# EAGLE design satshakit_cnc (EAGLE 7.5.0)
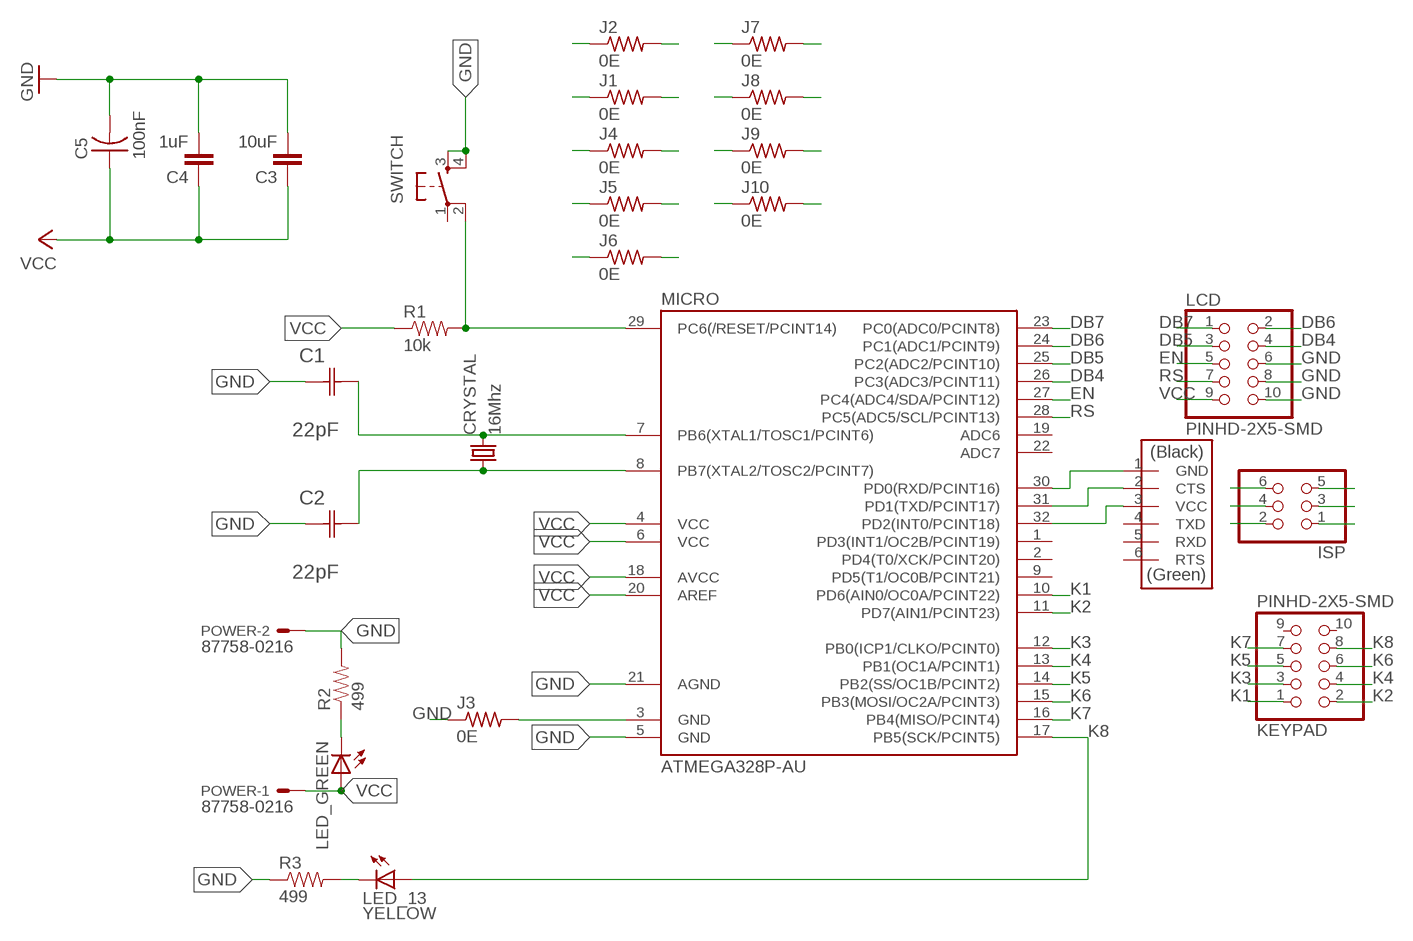
[diagram p0: schematic, sheet 1]

## Parts
C1  22pF  0612ZC225MAT2A  [CAPC3216X178N]
C2  22pF  0612ZC225MAT2A  [CAPC3216X178N]
C3  10uF  CAP1206  [1206]
C4  1uF  CAP1206  [1206]
C5  100nF  CAP-US1206FAB  [C1206FAB]
CRYSTAL  16Mhz  CSM-7X-DU  [CSM-7X-DU]
GSM  FTDI-SMD-HEADER  [1X06SMD]
ISP  PINHD-2X3-SMD  [2X03SMD]
J1  0E  RES-US1206FAB  [R1206FAB]
J2  0E  RES-US1206FAB  [R1206FAB]
J3  0E  RES-US1206FAB  [R1206FAB]
J4  0E  RES-US1206FAB  [R1206FAB]
J5  0E  RES-US1206FAB  [R1206FAB]
J6  0E  RES-US1206FAB  [R1206FAB]
J7  0E  RES-US1206FAB  [R1206FAB]
J8  0E  RES-US1206FAB  [R1206FAB]
J9  0E  RES-US1206FAB  [R1206FAB]
J10  0E  RES-US1206FAB  [R1206FAB]
KEYPAD  PINHD-2X5-SMD  [2X05SMD]
LCD  PINHD-2X5-SMD  [2X05SMD]
LED_13  YELLOW  LED1206  [1206]
LED_GREEN  LED1206  [1206]
MICRO  ATMEGA328P-AU  ATMEGA48/88/168-AU  [TQFP32-08]
POWER  87758-0216  [87758-0216]
R1  10k  RESISTOR1206  [1206]
R2  499  RESISTOR1206  [1206]
R3  499  RESISTOR1206  [1206]
SWITCH  6MM_SWITCH6MM_SWITCH  [6MM_SWITCH]

## Nets
DB4: LCD.4 MICRO.26(PC3(ADC3/PCINT11))
DB5: LCD.3 MICRO.25(PC2(ADC2/PCINT10))
DB6: LCD.2 MICRO.24(PC1(ADC1/PCINT9))
DB7: LCD.1 MICRO.23(PC0(ADC0/PCINT8))
EN: LCD.5 MICRO.27(PC4(ADC4/SDA/PCINT12))
GND: C1.1(C1) C2.1(C1) C3.2 C4.2 C5.2 ISP.6 J3.1 J3.2 J8.1 J8.2 J10.1 J10.2 LCD.6 LCD.8 LCD.10 MICRO.3(GND) MICRO.5(GND) MICRO.21(AGND) POWER.2 R2.2 R3.1 SWITCH.3(S) SWITCH.4(S1)
K1: KEYPAD.1 MICRO.10(PD6(AIN0/OC0A/PCINT22))
K2: KEYPAD.2 MICRO.11(PD7(AIN1/PCINT23))
K3: KEYPAD.3 MICRO.12(PB0(ICP1/CLKO/PCINT0))
K4: KEYPAD.4 MICRO.13(PB1(OC1A/PCINT1))
K5: KEYPAD.5 MICRO.14(PB2(SS/OC1B/PCINT2))
K6: ISP.4 KEYPAD.6 MICRO.15(PB3(MOSI/OC2A/PCINT3))
K7: ISP.1 J5.1 J5.2 KEYPAD.7 MICRO.16(PB4(MISO/PCINT4))
K8: ISP.3 J4.1 J4.2 KEYPAD.8 LED_13.1(A) MICRO.17(PB5(SCK/PCINT5))
N$1: GSM.1(GND) MICRO.30(PD0(RXD/PCINT16))
N$2: C1.2(C2) CRYSTAL.2 MICRO.7(PB6(XTAL1/TOSC1/PCINT6))
N$3: GSM.2(CTS) MICRO.31(PD1(TXD/PCINT17))
N$4: GSM.3(VCC) MICRO.32(PD2(INT0/PCINT18))
N$9: C2.2(C2) CRYSTAL.1 MICRO.8(PB7(XTAL2/TOSC2/PCINT7))
N$26: LED_GREEN.2(C) R2.1
N$27: LED_13.2(C) R3.2
RS: LCD.7 MICRO.28(PC5(ADC5/SCL/PCINT13))
RST: ISP.5 J1.1 J1.2 J9.1 J9.2 MICRO.29(PC6(/RESET/PCINT14)) R1.2 SWITCH.2(P1)
VCC: C3.1 C4.1 C5.1 ISP.2 J2.1 J2.2 J6.1 J6.2 J7.1 J7.2 LCD.9 LED_GREEN.1(A) MICRO.4(VCC) MICRO.6(VCC) MICRO.18(AVCC) MICRO.20(AREF) POWER.1 R1.1
Unconnected: GSM.4(TXD) GSM.5(RXD) GSM.6(RTS) KEYPAD.9 KEYPAD.10 MICRO.1(PD3(INT1/OC2B/PCINT19)) MICRO.2(PD4(T0/XCK/PCINT20)) MICRO.9(PD5(T1/OC0B/PCINT21)) MICRO.19(ADC6) MICRO.22(ADC7) SWITCH.1(P)

## Library data of the parts
C1 C2 = AVX_By_element14_Batch_1:0612ZC225MAT2A: Capacitor 1206; MPN: 0612ZC225MAT2A; OC_FARNELL: -; OC_NEWARK: 12N3209; SUPPLIER: AVX; TOLERANCE: ±20%; VALUE: 2.2µF; VOLTAGERATING: 10V
C3 C4 = 01_SparkFun:CAP: Capacitor Standard 0603 ceramic capacitor, and 0.1" leaded capacitor.
C5 = fab:CAP-US
CRYSTAL = 01_FAB_Hello:CSM-7X-DU: SMD CRYSTAL Source: www.ecsxtal.com .. Crystal 3.6864MHz CSM_7X_DU.PDF; OC_FARNELL: unknown; OC_NEWARK: unknown
GSM = fab:FTDI-SMD-HEADER
ISP = fab:PINHD-2X3-SMD: PIN HEADER
J1-J10 = fab:RES-US: Resistor (US Symbol) Variants with postfix FAB are widened to allow the routing of internal traces
KEYPAD LCD = fab:PINHD-2X5-SMD
LED_13 LED_GREEN = 01_FAB_Hello:LED
MICRO = atmega8:ATMEGA48/88/168
POWER = con-molex:87758-0216: 2 Pin - 2mm Dual Row Single Wafer, Vertical T/H HDR Source: http://www.molex.com/pdm_docs/sd/877580616_sd.pdf; MPN: 87758-0216; OC_FARNELL: unknown; OC_NEWARK: 94M1513
R1-R3 = 01_SparkFun:RESISTOR: Resistor Basic schematic elements and footprints for 0603, 1206, and PTH 1/10th watt (small) resistors.
SWITCH = 01_FAB_Hello:6MM_SWITCH: OMRON SWITCH

## Board
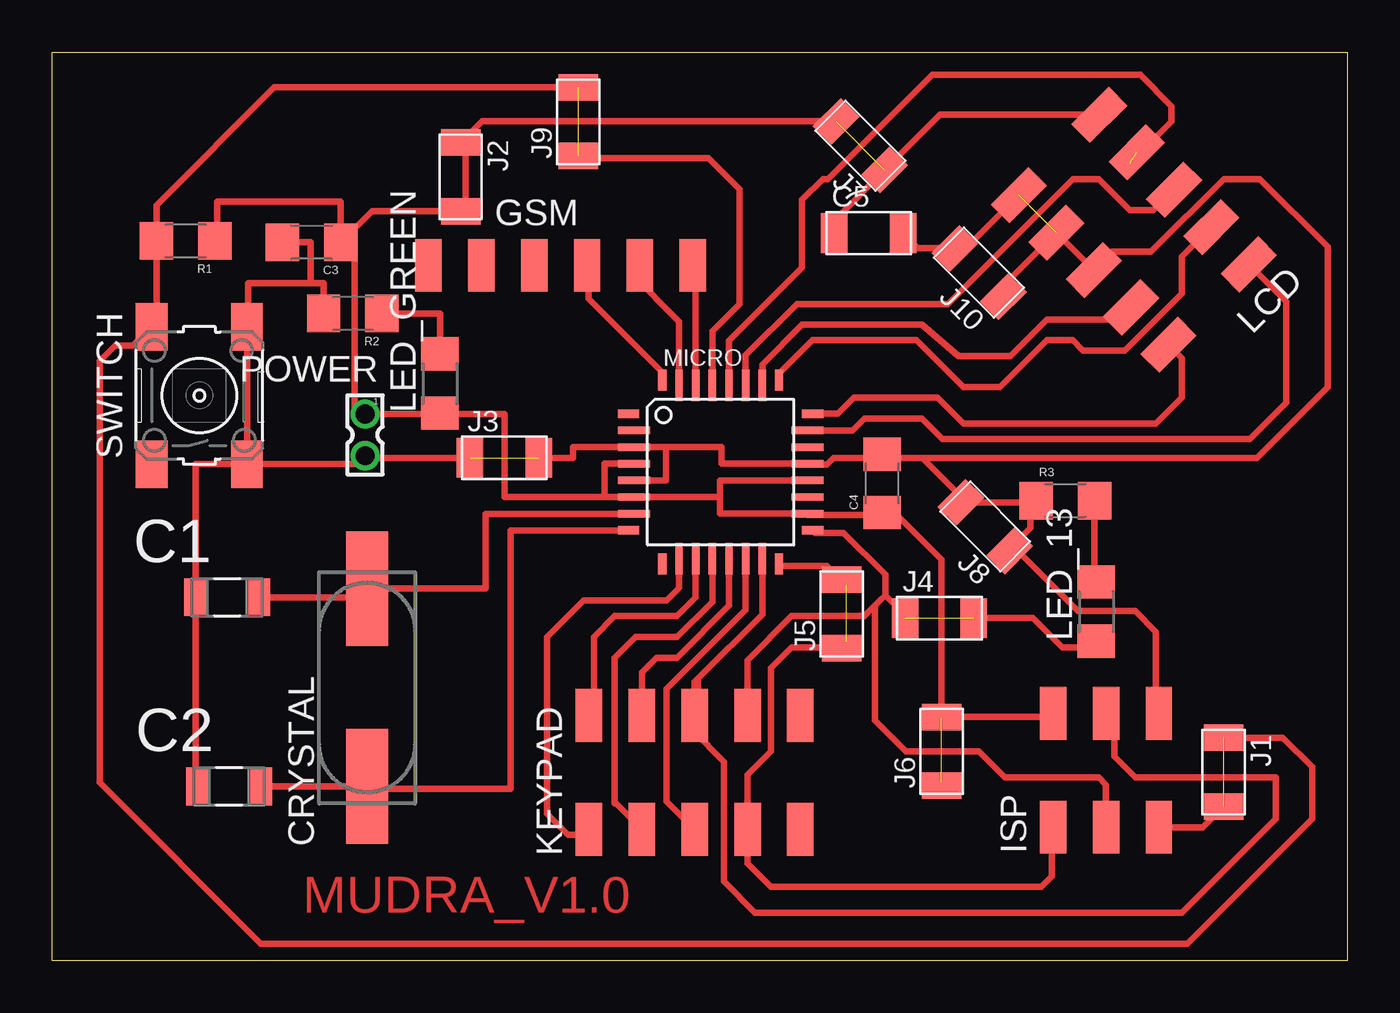
[diagram p1: board, top side]

Size 62.23 x 43.66 mm. Coordinates in mm from the lower left corner, seen from the top.
Outline: 62.23,43.66 62.23,0 0,0 0,43.66 62.23,43.66
Copper layers (1*16): Top 0.035mm / dielectric 1.5mm / Bottom 0.035mm
Design rules "default *": minimum track width 12mil, minimum drill 24mil, track to track 12mil, track to pad 12mil, pad to pad 12mil, via to via 12mil, smd to smd 12mil, copper to edge 40mil, drill to drill 8mil, minimum pad ring 10mil, minimum via ring 8mil, stop-mask expansion 4mil, vias tented up to drill 0mil, thermal gap 10mil

### Footprints (pad centres in the part's own frame; a part is rotated, then mirrored left to right if it is on the bottom)
CAPC3216X178N = smd 1.118 x 1.803: 1 -1.499,0; 2 1.499,0
1206 = smd 1.6 x 1.8: 1 -1.4,0; 2 1.4,0
C1206FAB = smd 1.27 x 1.905: 1 -1.651,0; 2 1.651,0
CSM-7X-DU = smd 5.5 x 2: 1 -4.75,0; 2 4.75,0
1X06SMD = smd 2.54 x 1.27: 1 0,6.35; 2 0,3.81; 3 0,1.27; 4 0,-1.27; 5 0,-3.81; 6 0,-6.35
2X03SMD = smd 2.54 x 1.27: 1 -2.54,2.54; 2 2.92,2.54; 3 -2.54,0; 4 2.92,0; 5 -2.54,-2.54; 6 2.92,-2.54
R1206FAB = smd 1.27 x 1.905: 1 -1.651,0; 2 1.651,0
2X05SMD = smd 2.54 x 1.27: 1 -2.54,2.54; 2 2.92,2.54; 3 -2.54,0; 4 2.92,0; 5 -2.54,-2.54; 6 2.92,-2.54; 7 -2.54,-5.08; 8 2.92,-5.08; 9 -2.54,-7.62; 10 2.92,-7.62
1206' = smd 1.6 x 1.803: 1 -1.422,0; 2 1.422,0
TQFP32-08 = smd 1.016 x 0.406: 1 -4.42,2.8; 8 -4.42,-2.8; 17 4.42,-2.8; 24 4.42,2.8 | smd 1.524 x 0.356: 2 -4.166,2; 3 -4.166,1.2; 4 -4.166,0.4; 5 -4.166,-0.4; 6 -4.166,-1.2; 7 -4.166,-2; 18 4.166,-2; 19 4.166,-1.2; 20 4.166,-0.4; 21 4.166,0.4; 22 4.166,1.2; 23 4.166,2 | smd 0.406 x 1.016: 9 -2.8,-4.42; 16 2.8,-4.42; 25 2.8,4.42; 32 -2.8,4.42 | smd 0.356 x 1.524: 10 -2,-4.166; 11 -1.2,-4.166; 12 -0.4,-4.166; 13 0.4,-4.166; 14 1.2,-4.166; 15 2,-4.166; 26 2,4.166; 27 1.2,4.166; 28 0.4,4.166; 29 -0.4,4.166; 30 -1.2,4.166; 31 -2,4.166
87758-0216 = drill 0.9 pad 1.27: 1 0,-1; 2 0,1
6MM_SWITCH = smd 2.286 x 1.524: 1 -3.302,2.286; 2 3.302,2.286; 3 -3.302,-2.286; 4 3.302,-2.286

### Placement (x,y rotation side)
C1  8.41,17.46 0 top
C2  8.51,8.38 0 top
C3  12.47,34.52 180 top
C4  39.88,22.94 90 top
C5  39.23,34.96 0 top
CRYSTAL  15.14,13.13 90 top
GSM  24.43,33.41 270 top
ISP  50.63,8.96 90 top
J1  56.28,9.06 270 top
J2  19.63,37.66 270 top
J3  21.73,24.16 0 top
J4  42.63,16.46 0 top
J5  37.93,16.66 90 top
J6  42.73,10.06 90 top
J7  38.83,39.16 135 top
J8  44.83,20.86 135 top
J9  25.28,40.31 90 top
J10  44.53,33.06 135 top
KEYPAD  28.33,8.86 90 top
LCD  53.9,33.46 225 top
LED_13  YELLOW  [1206']  50.16,16.77 90 top
LED_GREEN  [1206']  18.64,27.73 90 top
MICRO  32.12,23.48 0 top
POWER  15.04,25.27 180 top
R1  6.42,34.58 180 top
R2  14.45,31.1 180 top
R3  48.68,22.11 0 top
SWITCH  7.08,27.16 90 top

### Tracks (layer width: path | path; a pad name or v marks a point on that pad's centre or on a via)
DB4
  Top 0.305: MICRO.26 34.12,28.65 36.03,30.56 41.78,30.56 43.53,29.06 46.03,29.06 47.78,30.81 51.25,30.81 LCD.4
DB5
  Top 0.305: MICRO.25 34.92,28.2 36.53,29.81 41.53,29.81 43.78,27.56 45.53,27.56 47.78,29.81 49.03,29.81 49.53,29.31 51.53,29.31 54.28,32.06 54.28,33.84 LCD.3
DB6
  Top 0.305: MICRO.24 37.75,26.28 38.53,27.06 42.53,27.06 43.78,25.81 53.03,25.81 54.28,27.06 54.28,28.95 LCD.2
DB7
  Top 0.305: MICRO.23 38.45,25.48 39.03,26.06 41.78,26.06 42.78,25.06 57.53,25.06 59.28,26.81 59.28,31.67 LCD.1
EN
  Top 0.305: MICRO.27 33.32,29.1 35.78,31.56 43.03,31.56 49.03,37.56 50.28,37.56 51.78,36.06 52.91,36.06 LCD.5
GND  (2 unrouted)
  Top 0.305: 29.5,24.68 29.5,23.08 MICRO.5 | MICRO.5 | 29.5,24.68 32.15,24.68 32.15,23.89 MICRO.21 36.32,23.85 37.24,23.85 37.54,24.15 39.68,24.15 C4.2 39.98,24.15 41.81,24.15 | C2.1 6.91,8.38 C1.1 6.91,23.86 SWITCH.3 | C3.2 12.43,34.52 12.43,32.56 | 12.43,32.56 13.05,32.56 R2.2 | 12.43,32.56 9.43,32.56 9.43,30.46 SWITCH.4 SWITCH.3 | SWITCH.3 15.04,23.86 POWER.2 15.04,24.16 J3.1 | 29.5,24.68 MICRO.3 25.03,24.68 25.03,24.16 J3.2 | 46.99,22.02 46.99,20.8 46.08,19.89 J8.1 46.4,19.69 49.28,16.81 52.03,16.81 53.03,15.81 53.03,12.02 ISP.6 | 46.99,22.02 43.94,22.02 J8.2 43.64,22.32 41.81,24.15 | 46.99,22.02 R3.1 | 41.81,24.15 57.87,24.15 61.28,27.56 61.28,34.31 58.03,37.56 56.28,37.56 52.78,34.06 50.91,34.06 LCD.6 LCD.8 45.7,32.44 J10.1 | LCD.10 43.89,34.23 J10.2 41.61,34.23 C5.2
K1
  Top 0.305: MICRO.10 30.12,17.9 29.53,17.31 25.53,17.31 23.78,15.56 23.78,7.06 24.78,6.06 25.53,6.06 KEYPAD.1
K2
  Top 0.305: MICRO.11 30.92,17.45 30.03,16.56 27.03,16.56 26.03,15.56 26.03,12.02 KEYPAD.2
K3
  Top 0.305: MICRO.12 31.72,17.25 30.03,15.56 28.03,15.56 27.03,14.56 27.03,7.56 27.09,7.56 KEYPAD.3
K4
  Top 0.305: KEYPAD.4 28.33,13.86 29.03,14.56 30.03,14.56 32.53,17.06 MICRO.13
K5
  Top 0.305: MICRO.14 33.32,16.85 29.53,13.06 29.53,7.66 KEYPAD.5
K6
  Top 0.305: KEYPAD.6 30.87,13.4 31.03,13.56 | MICRO.15 34.12,16.65 31.03,13.56 | 31.03,13.56 31.03,11.56 30.78,11.31 30.78,11.06 32.28,9.56 32.28,3.81 33.78,2.31 54.28,2.31 58.78,6.81 58.78,8.81 52.03,8.81 51.03,9.81 51.03,11.48 ISP.4
K7  (1 unrouted)
  Top 0.305: MICRO.16 35.1,18.97 37.24,18.97 37.85,18.36 J5.2 38.15,18.06 | 38.15,15.31 J5.1 37.98,15.06 | ISP.1 48.03,6.36 48.03,4.06 47.53,3.56 34.53,3.56 33.41,4.68 KEYPAD.7 33.41,8.94 34.53,10.06 34.53,14.06 35.53,15.06 37.98,15.06 | 38.53,15.06 37.98,15.06
K8  (1 unrouted)
  Top 0.305: KEYPAD.8 33.41,14.44 35.53,16.56 39.03,16.56 39.53,17.06 | 40.03,17.56 39.78,17.31 39.53,17.06 | 40.03,17.56 40.03,18.56 38.03,20.56 36.66,20.56 MICRO.17 | J4.1 40.98,16.61 40.03,17.56 | J4.2 47.13,16.46 48.53,15.06 49.87,15.06 LED_13.1 | ISP.3 50.63,8.46 50.28,8.81 45.78,8.81 44.53,10.06 41.03,10.06 39.53,11.56 39.53,17.06
N$1
  Top 0.305: MICRO.30 30.92,33.27 GSM.1
N$2
  Top 0.305: C1.2 15.14,17.46 CRYSTAL.2 20.83,17.88 20.83,21.46 27.95,21.46 MICRO.7
N$3
  Top 0.305: MICRO.31 30.12,30.72 27.78,33.06 27.89,33.06 GSM.2
N$4
  Top 0.305: MICRO.32 29.32,28.27 25.78,31.81 25.78,33.33 GSM.3
N$9
  Top 0.305: C2.2 CRYSTAL.1 | CRYSTAL.1 | MICRO.8 22.03,20.68 22.03,8.26 15.14,8.26 CRYSTAL.1
N$26
  Top 0.305: R2.1 18.64,31.1 LED_GREEN.2
N$27
  Top 0.305: R3.2 50.08,18.28 LED_13.2
RS  (1 unrouted)
  Top 0.305: MICRO.28 32.52,29.8 36.03,33.31 36.03,36.56 37.03,37.56 37.28,37.56 42.28,42.56 52.28,42.56 53.78,41.06 53.78,40.31 51.78,38.31
RST  (2 unrouted)
  Top 0.305: ISP.5 55.29,6.42 J1.2 | J1.1 59.13,10.71 60.53,9.31 60.53,6.81 54.53,0.81 10.03,0.81 2.28,8.56 2.28,28.81 3.03,29.56 3.89,29.56 SWITCH.2 5.02,30.46 R1.2 5.03,36.31 10.68,41.96 J9.2 | MICRO.29 31.72,30.25 33.03,31.56 33.03,37.06 31.53,38.56 25.38,38.56 J9.1
VCC  (2 unrouted)
  Top 0.305: MICRO.4 26.53,23.88 26.53,22.28 | 26.53,22.28 MICRO.6 32.09,22.28 | 32.09,22.28 32.09,23.08 MICRO.20 | MICRO.20 | 32.09,22.28 32.09,21.48 MICRO.18 36.32,21.41 39.68,21.41 C4.1 39.98,21.41 40.59,21.41 42.72,19.28 42.72,11.96 J6.2 | R1.1 7.93,34.58 7.93,36.46 13.87,36.46 C3.1 | C3.1 13.87,33.76 14.53,33.76 14.53,26.27 POWER.1 18.13,26.27 | 18.13,26.27 18.64,26.27 LED_GREEN.1 | 26.53,22.28 21.73,22.28 21.73,26.26 18.13,26.26 18.13,26.27 | C3.1 15.36,36.01 J2.2 19.86,36.04 19.86,39.09 J2.1 20.65,40.33 J7.2 | 42.72,8.61 J6.1 | 42.72,11.66 J6.2 | J6.2 47.92,11.71 ISP.2 | LCD.9 42.65,40.64 J7.1 37.58,35.57 C5.1

### Text on the board
Top: MUDRA_V1.0